# EAGLE design test (EAGLE 6.1)
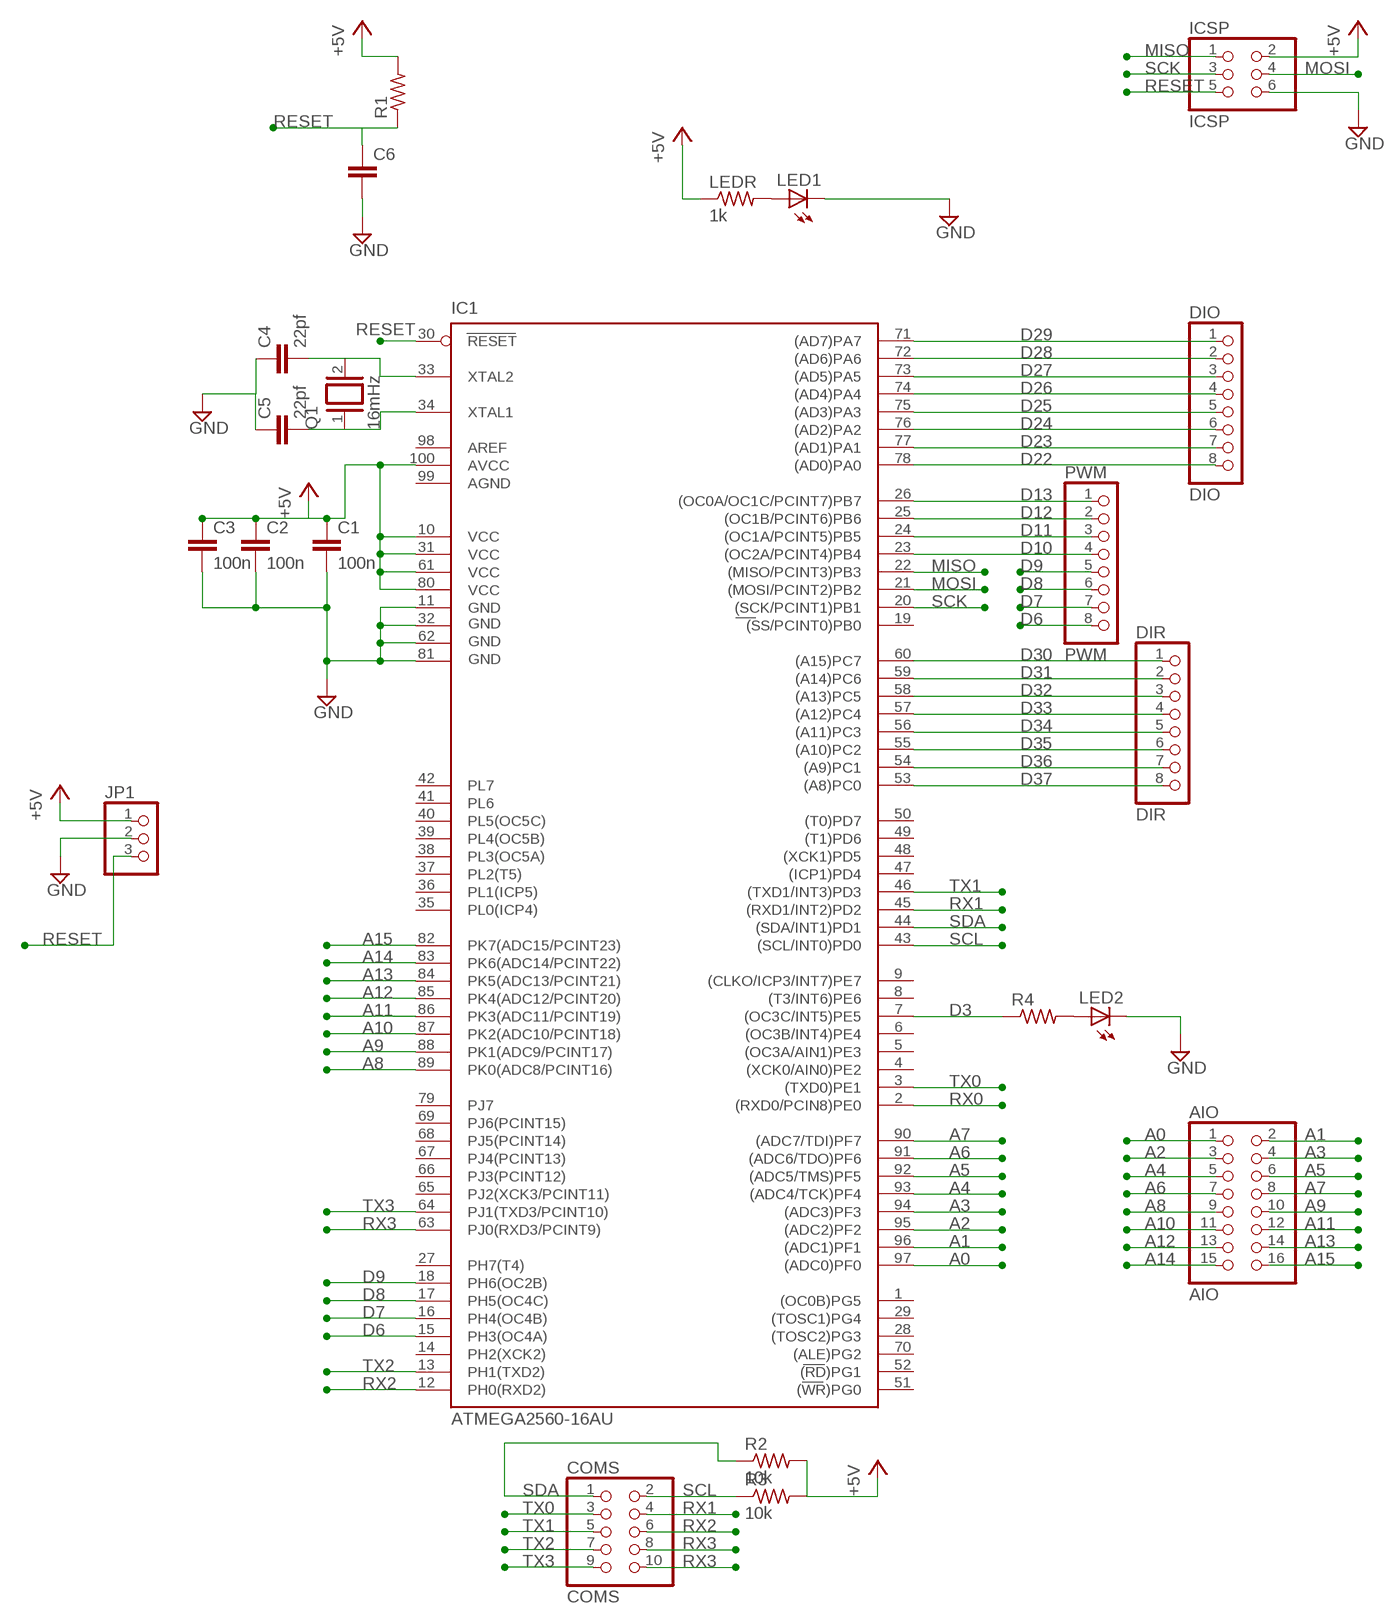
[diagram p0: schematic, sheet 1]

## Parts
AIO  AIO  PINHD-2X8  [2X08]
C1  100n  C5/3.5  [C5B3.5]
C2  100n  C5/3.5  [C5B3.5]
C3  100n  C5/3.5  [C5B3.5]
C4  22pf  C5/3.5  [C5B3.5]
C5  22pf  C5/3.5  [C5B3.5]
C6  C5/3.5  [C5B3.5]
COMS  COMS  PINHD-2X5  [2X05]
DIO  DIO  PINHD-1X8  [1X08]
DIR  DIR  PINHD-1X8  [1X08]
IC1  ATMEGA2560-16AU  [TQFP100]
ICSP  ICSP  PINHD-2X3  [2X03]
JP1  PINHD-1X3  [1X03]
LED1  LEDB156  [Q62902-B156]
LED2  LEDB156  [Q62902-B156]
LEDR  1k  R-US_0207/7  [0207/7]
PWM  PWM  PINHD-1X8  [1X08]
Q1  16mHz  XTAL/S  [QS]
R1  R-US_0207/7  [0207/7]
R2  10k  R-US_0207/7  [0207/7]
R3  10k  R-US_0207/7  [0207/7]
R4  R-US_0207/7  [0207/7]

## Nets
+5V: C1.1 C2.1 C3.1 IC1.10(VCC) IC1.31(VCC1) IC1.61(VCC2) IC1.80(VCC3) IC1.100(AVCC) ICSP.2 JP1.1 LEDR.1 R1.2 R2.2 R3.2
A0: AIO.1 IC1.97((ADC0)PF0)
A1: AIO.2 IC1.96((ADC1)PF1)
A2: AIO.3 IC1.95((ADC2)PF2)
A3: AIO.4 IC1.94((ADC3)PF3)
A4: AIO.5 IC1.93((ADC4/TCK)PF4)
A5: AIO.6 IC1.92((ADC5/TMS)PF5)
A6: AIO.7 IC1.91((ADC6/TDO)PF6)
A7: AIO.8 IC1.90((ADC7/TDI)PF7)
A8: AIO.9 IC1.89(PK0(ADC8/PCINT16))
A9: AIO.10 IC1.88(PK1(ADC9/PCINT17))
A10: AIO.11 IC1.87(PK2(ADC10/PCINT18))
A11: AIO.12 IC1.86(PK3(ADC11/PCINT19))
A12: AIO.13 IC1.85(PK4(ADC12/PCINT20))
A13: AIO.14 IC1.84(PK5(ADC13/PCINT21))
A14: AIO.15 IC1.83(PK6(ADC14/PCINT22))
A15: AIO.16 IC1.82(PK7(ADC15/PCINT23))
D3: IC1.7((OC3C/INT5)PE5) R4.1
D6: IC1.15(PH3(OC4A)) PWM.8
D7: IC1.16(PH4(OC4B)) PWM.7
D8: IC1.17(PH5(OC4C)) PWM.6
D9: IC1.18(PH6(OC2B)) PWM.5
D10: IC1.23((OC2A/PCINT4)PB4) PWM.4
D11: IC1.24((OC1A/PCINT5)PB5) PWM.3
D12: IC1.25((OC1B/PCINT6)PB6) PWM.2
D13: IC1.26((OC0A/OC1C/PCINT7)PB7) PWM.1
D22: DIO.8 IC1.78((AD0)PA0)
D23: DIO.7 IC1.77((AD1)PA1)
D24: DIO.6 IC1.76((AD2)PA2)
D25: DIO.5 IC1.75((AD3)PA3)
D26: DIO.4 IC1.74((AD4)PA4)
D27: DIO.3 IC1.73((AD5)PA5)
D28: DIO.2 IC1.72((AD6)PA6)
D29: DIO.1 IC1.71((AD7)PA7)
D30: DIR.1 IC1.60((A15)PC7)
D31: DIR.2 IC1.59((A14)PC6)
D32: DIR.3 IC1.58((A13)PC5)
D33: DIR.4 IC1.57((A12)PC4)
D34: DIR.5 IC1.56((A11)PC3)
D35: DIR.6 IC1.55((A10)PC2)
D36: DIR.7 IC1.54((A9)PC1)
D37: DIR.8 IC1.53((A8)PC0)
GND: C1.2 C2.2 C3.2 C4.1 C5.1 C6.2 IC1.11(GND) IC1.32(GND1) IC1.62(GND2) IC1.81(GND3) ICSP.6 JP1.2 LED1.K(C) LED2.K(C)
MISO: IC1.22((MISO/PCINT3)PB3) ICSP.1
MOSI: IC1.21((MOSI/PCINT2)PB2) ICSP.4
N$1: C4.2 IC1.33(XTAL2) Q1.2
N$2: C5.2 IC1.34(XTAL1) Q1.1
N$3: LED1.A LEDR.2
N$5: LED2.A R4.2
RESET: C6.1 IC1.30(RESET) ICSP.5 JP1.3 R1.1
RX0: IC1.2((RXD0/PCIN8)PE0)
RX1: COMS.4 IC1.45((RXD1/INT2)PD2)
RX2: COMS.6 IC1.12(PH0(RXD2))
RX3: COMS.8 COMS.10 IC1.63(PJ0(RXD3/PCINT9))
SCK: IC1.20((SCK/PCINT1)PB1) ICSP.3
SCL: COMS.2 IC1.43((SCL/INT0)PD0) R3.1
SDA: COMS.1 IC1.44((SDA/INT1)PD1) R2.1
TX0: COMS.3 IC1.3((TXD0)PE1)
TX1: COMS.5 IC1.46((TXD1/INT3)PD3)
TX2: COMS.7 IC1.13(PH1(TXD2))
TX3: COMS.9 IC1.64(PJ1(TXD3/PCINT10))
Unconnected: IC1.1((OC0B)PG5) IC1.4((XCK0/AIN0)PE2) IC1.5((OC3A/AIN1)PE3) IC1.6((OC3B/INT4)PE4) IC1.8((T3/INT6)PE6) IC1.9((CLKO/ICP3/INT7)PE7) IC1.14(PH2(XCK2)) IC1.19((SS/PCINT0)PB0) IC1.27(PH7(T4)) IC1.28((TOSC2)PG3) IC1.29((TOSC1)PG4) IC1.35(PL0(ICP4)) IC1.36(PL1(ICP5)) IC1.37(PL2(T5)) IC1.38(PL3(OC5A)) IC1.39(PL4(OC5B)) IC1.40(PL5(OC5C)) IC1.41(PL6) IC1.42(PL7) IC1.47((ICP1)PD4) IC1.48((XCK1)PD5) IC1.49((T1)PD6) IC1.50((T0)PD7) IC1.51((WR)PG0) IC1.52((RD)PG1) IC1.65(PJ2(XCK3/PCINT11)) IC1.66(PJ3(PCINT12)) IC1.67(PJ4(PCINT13)) IC1.68(PJ5(PCINT14)) IC1.69(PJ6(PCINT15)) IC1.70((ALE)PG2) IC1.79(PJ7) IC1.98(AREF)

## Power pins joined to a net without a drawn wire
AGND: IC1.99(AGND)

## Library data of the parts
AIO = pinhead:PINHD-2X8: PIN HEADER
C1-C6 = capacitor-wima:C: CAPACITOR naming: grid - package width
COMS = pinhead:PINHD-2X5: PIN HEADER
DIO DIR PWM = pinhead:PINHD-1X8: PIN HEADER
IC1 = atmel-2005:ATMEGA*: MICROCONTROLLER 64/128/256 Kbytes FLASH 4 Kbytes EEPROM 8 Kbytes SRAM 86 General Purpose I/O pins 12-channels16-bit PWM 4 x Serial USARTs 16-channels 10-bit A/D
ICSP = pinhead:PINHD-2X3: PIN HEADER
JP1 = pinhead:PINHD-1X3: PIN HEADER
LED1 LED2 = led:LED: LED OSRAM: - CHIPLED LG R971, LG N971, LY N971, LG Q971, LY Q971, LO R971, LY R971 LH N974, LH R974 LS Q976, LO Q976, LY Q976 LO Q996 - Hyper CHIPLED LW Q18S LB Q993, LB Q99A, LB R99A - SideLED LS A670, LO A670, LY A670, LG A670, LP A670 LB A673, LV A673, LT A673, LW A673 LH A674 LY A675 LS A676, LA A676, LO A676, LY A676, LW A676 LS A679, LY A679, LG A679 - Hyper Micro SIDELED® LS Y876, LA Y876, LO Y876, LY Y876 LT Y87S - SmartLED LW L88C, LW L88S LB L89C, LB L89S, LG L890 LS L89K, LO L89K, LY L89K LS L896, LA L896, LO L896, LY L896 - TOPLED LS T670, LO T670, LY T670, LG T670, LP T670 LSG T670, LSP T670, LSY T670, LOP T670, LYG T670 LG T671, LOG T671, LSG T671 LB T673, LV T673, LT T673, LW T673 LH T674 LS T676, LA T676, LO T676, LY T676, LB T676, LH T676, LSB T676, LW T676 LB T67C, LV T67C, LT T67C, LS T67K, LO T67K, LY T67K, LW E67C LS E67B, LA E67B, LO E67B, LY E67B, LB E67C, LV E67C, LT E67C LW T67C LS T679, LY T679, LG T679 LS T770, LO T770, LY T770, LG T770, LP T770 LB T773, LV T773, LT T773, LW T773 LH T774 LS E675, LA E675, LY E675, LS T675 LS T776, LA T776, LO T776, LY T776, LB T776 LHGB T686 LT T68C, LB T68C - Hyper Mini TOPLED® LB M676 - Mini TOPLED Santana® LG M470 LS M47K, LO M47K, LY M47K Source: http://www.osram.convergy.de LUXEON: - LUMILED® LXK2-PW12-R00, LXK2-PW12-S00, LXK2-PW14-U00, LXK2-PW14-V00 LXK2-PM12-R00, LXK2-PM12-S00, LXK2-PM14-U00 LXK2-PE12-Q00, LXK2-PE12-R00, LXK2-PE12-S00, LXK2-PE14-T00, LXK2-PE14-U00 LXK2-PB12-K00, LXK2-PB12-L00, LXK2-PB12-M00, LXK2-PB14-N00, LXK2-PB14-P00, LXK2-PB14-Q00 LXK2-PR12-L00, LXK2-PR12-M00, LXK2-PR14-Q00, LXK2-PR14-R00 LXK2-PD12-Q00, LXK2-PD12-R00, LXK2-PD12-S00 LXK2-PH12-R00, LXK2-PH12-S00 LXK2-PL12-P00, LXK2-PL12-Q00, LXK2-PL12-R00 Source: www.luxeon.com KINGBRIGHT: KA-3528ASYC Source: www.kingbright.com
LEDR R1 = rcl:R-US_: RESISTOR, American symbol
Q1 = special:XTAL/S: CRYSTAL
R2-R4 = resistor:R-US_: RESISTOR, American symbol

## Board
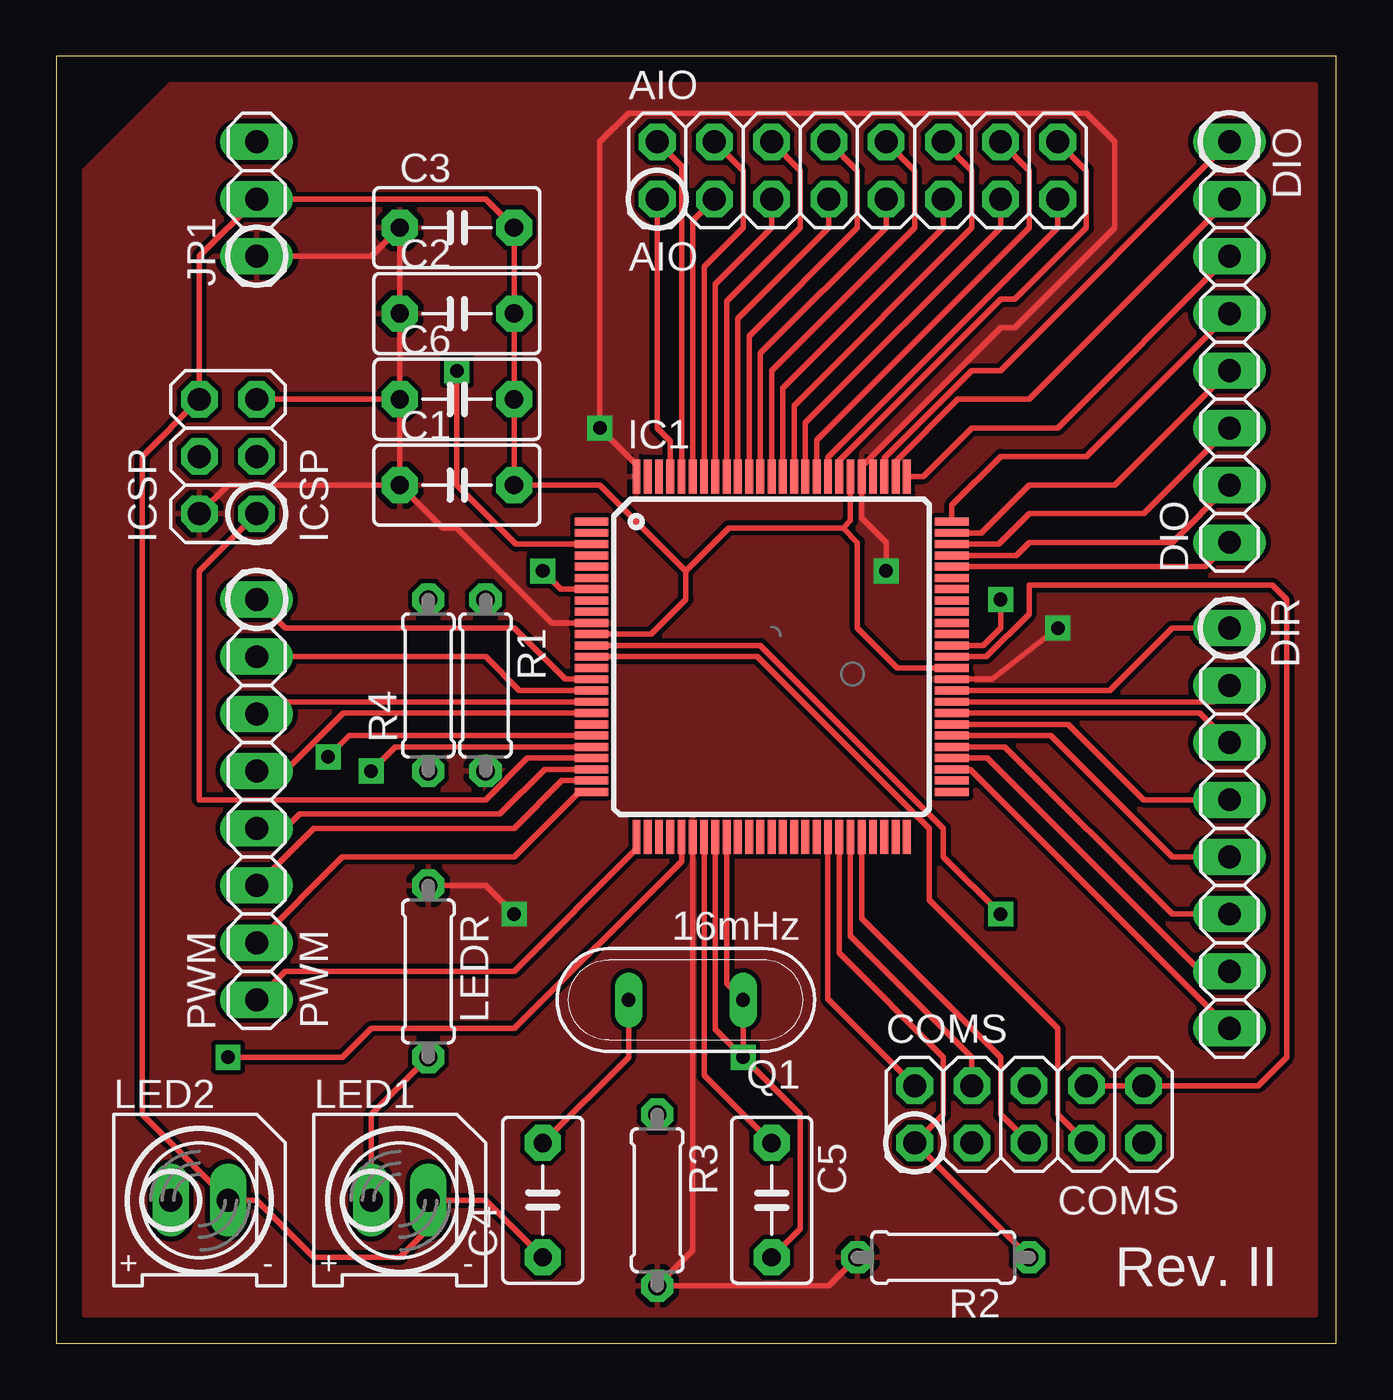
[diagram p1: board, top side]
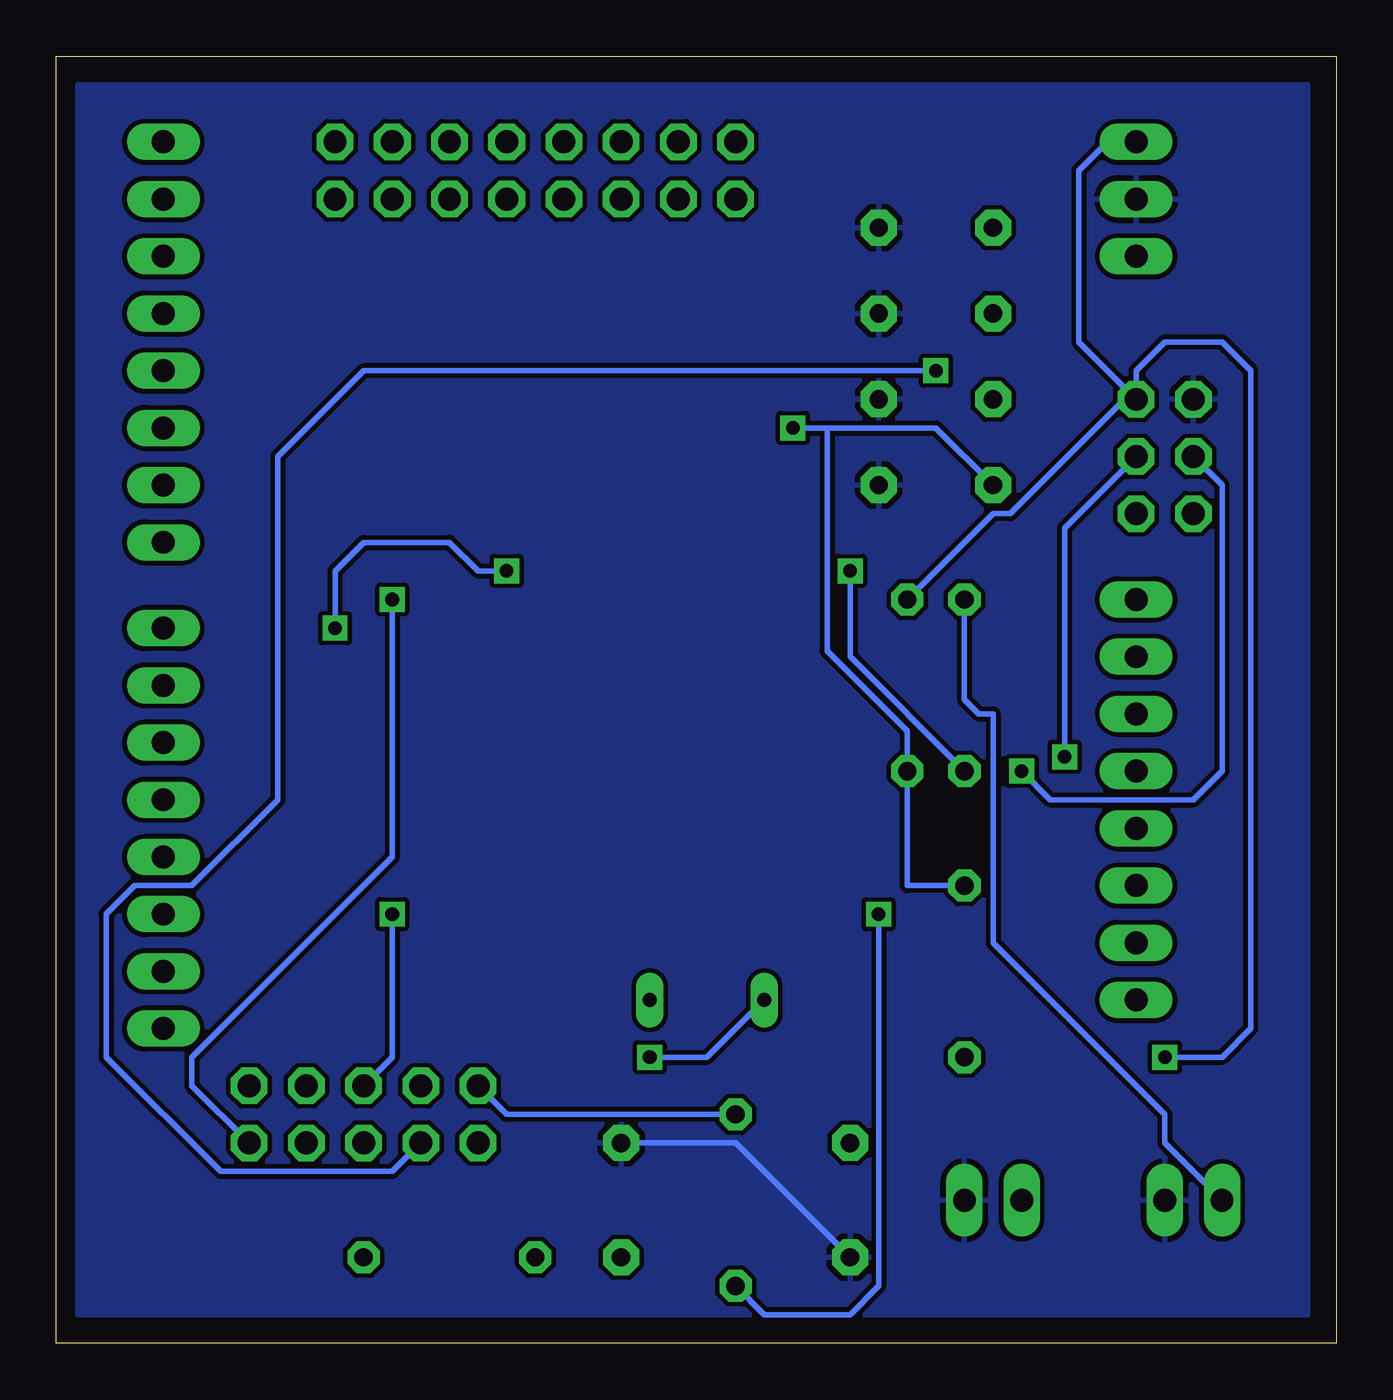
[diagram p2: board, bottom side, seen from below]

Size 56.82 x 57.14 mm. Coordinates in mm from the lower left corner, seen from the top.
Outline: 0,0 56.82,0 56.82,57.14 0,57.14 0,0
Copper layers (1*16): Top 0.035mm / dielectric 1.5mm / Bottom 0.035mm
Design rules: minimum track width 8mil, minimum drill 20mil, track to track 8mil, track to pad 8mil, pad to pad 8mil, via to via 8mil, smd to smd 8mil, copper to edge 10mil, drill to drill 8mil, minimum pad ring 12mil, minimum via ring 10mil, stop-mask expansion 4mil, vias tented up to drill 25mil, thermal gap 10mil

### Footprints (pad centres in the part's own frame; a part is rotated, then mirrored left to right if it is on the bottom)
2X08 = drill 1.016 octagon: 1 -8.89,-1.27; 2 -8.89,1.27; 3 -6.35,-1.27; 4 -6.35,1.27; 5 -3.81,-1.27; 6 -3.81,1.27; 7 -1.27,-1.27; 8 -1.27,1.27; 9 1.27,-1.27; 10 1.27,1.27; 11 3.81,-1.27; 12 3.81,1.27; 13 6.35,-1.27; 14 6.35,1.27; 15 8.89,-1.27; 16 8.89,1.27
C5B3.5 = drill 0.813 pad 1.6 octagon: 1 -2.54,0; 2 2.54,0
2X05 = drill 1.016 octagon: 1 -5.08,-1.27; 2 -5.08,1.27; 3 -2.54,-1.27; 4 -2.54,1.27; 5 0,-1.27; 6 0,1.27; 7 2.54,-1.27; 8 2.54,1.27; 9 5.08,-1.27; 10 5.08,1.27
1X08 = drill 1.016 long: 1 -8.89,0; 2 -6.35,0; 3 -3.81,0; 4 -1.27,0; 5 1.27,0; 6 3.81,0; 7 6.35,0; 8 8.89,0
TQFP100 = smd 1.5 x 0.35: 1 -8,6; 2 -8,5.5; 3 -8,5; 4 -8,4.5; 5 -8,4; 6 -8,3.5; 7 -8,3; 8 -8,2.5; 9 -8,2; 10 -8,1.5; 11 -8,1; 12 -8,0.5; 13 -8,0; 14 -8,-0.5; 15 -8,-1; 16 -8,-1.5; 17 -8,-2; 18 -8,-2.5; 19 -8,-3; 20 -8,-3.5; 21 -8,-4; 22 -8,-4.5; 23 -8,-5; 24 -8,-5.5; 25 -8,-6; 51 8,-6; 52 8,-5.5; 53 8,-5; 54 8,-4.5; 55 8,-4; 56 8,-3.5; 57 8,-3; 58 8,-2.5; 59 8,-2; 60 8,-1.5; 61 8,-1; 62 8,-0.5; 63 8,0; 64 8,0.5; 65 8,1; 66 8,1.5; 67 8,2; 68 8,2.5; 69 8,3; 70 8,3.5; 71 8,4; 72 8,4.5; 73 8,5; 74 8,5.5; 75 8,6 | smd 0.35 x 1.5: 26 -6,-8; 27 -5.5,-8; 28 -5,-8; 29 -4.5,-8; 30 -4,-8; 31 -3.5,-8; 32 -3,-8; 33 -2.5,-8; 34 -2,-8; 35 -1.5,-8; 36 -1,-8; 37 -0.5,-8; 38 0,-8; 39 0.5,-8; 40 1,-8; 41 1.5,-8; 42 2,-8; 43 2.5,-8; 44 3,-8; 45 3.5,-8; 46 4,-8; 47 4.5,-8; 48 5,-8; 49 5.5,-8; 50 6,-8; 76 6,8; 77 5.5,8; 78 5,8; 79 4.5,8; 80 4,8; 81 3.5,8; 82 3,8; 83 2.5,8; 84 2,8; 85 1.5,8; 86 1,8; 87 0.5,8; 88 0,8; 89 -0.5,8; 90 -1,8; 91 -1.5,8; 92 -2,8; 93 -2.5,8; 94 -3,8; 95 -3.5,8; 96 -4,8; 97 -4.5,8; 98 -5,8; 99 -5.5,8; 100 -6,8
2X03 = drill 1.016 octagon: 1 -2.54,-1.27; 2 -2.54,1.27; 3 0,-1.27; 4 0,1.27; 5 2.54,-1.27; 6 2.54,1.27
1X03 = drill 1.016 long: 1 -2.54,0; 2 0,0; 3 2.54,0
Q62902-B156 = drill 1.016 long: A -1.27,0; K 1.27,0
0207/7 = drill 0.813 octagon: 1 -3.81,0; 2 3.81,0
QS = drill 0.61 long: 1 -2.54,0; 2 2.54,0

### Placement (x,y rotation side)
AIO  35.56,52.07 0 top
C1  17.78,38.1 0 top
C2  17.78,45.72 0 top
C3  17.78,49.53 0 top
C4  21.59,6.35 90 top
C5  31.75,6.35 270 top
C6  17.78,41.91 0 top
COMS  43.18,10.16 0 top
DIO  52.07,44.45 90 top
DIR  52.07,22.86 270 top
IC1  31.75,30.48 0 top
ICSP  7.62,39.37 90 top
JP1  8.89,50.8 90 top
LED1  15.24,6.35 0 top
LED2  6.35,6.35 0 top
LEDR  16.51,16.51 270 top
PWM  8.89,24.13 90 top
Q1  27.94,15.24 180 top
R1  19.05,29.21 270 top
R2  39.37,3.81 180 top
R3  26.67,6.35 270 top
R4  16.51,29.21 90 top

### Tracks (layer width: path | path; a pad name or v marks a point on that pad's centre or on a via)
+5V  (via drill 0.6)
  Top 0.254: IC1.31 28.25,4.12 R3.2 34.29,2.54 R2.2 | C1.1 7.62,38.1 ICSP.2 | IC1.10 21.99,31.98 17.78,36.2 17.15,36.2 C1.1 | C1.1 C2.1 C3.1 13.97,48.26 JP1.1 | IC1.100 25.75,39.02 v24.13,40.64 24.13,53.34 25.4,54.61 45.72,54.61 46.99,53.34 46.99,49.53 42.55,45.08 41.91,45.08 35.75,38.92 IC1.80 35.75,36.64 36.83,35.56 v36.83,34.29 | LEDR.1 19.05,20.32 v20.32,19.05 | IC1.61 41.55,29.48 v44.45,31.75
  Bottom 0.254: v24.13,40.64 22.61,40.64 | 22.61,40.64 17.78,40.64 C1.1 | v20.32,19.05 20.32,2.54 21.59,1.27 25.4,1.27 R3.2 | LEDR.1 19.05,20.32 R1.2 19.05,27.18 22.61,30.73 22.61,40.64 | v44.45,31.75 44.45,34.29 43.18,35.56 39.37,35.56 38.1,34.29 v36.83,34.29
  pour Top: 1.27,52.07 5.08,55.88 55.88,55.88 55.88,1.27 1.27,1.27
A0
  Top 0.254: IC1.97 27.25,40.06 26.67,40.64 AIO.1
A1
  Top 0.254: IC1.96 27.75,52.26 AIO.2
A2
  Top 0.254: IC1.95 28.25,49.84 AIO.3
A3
  Top 0.254: IC1.94 28.75,47.8 30.48,49.53 30.48,52.07 AIO.4
A4
  Top 0.254: IC1.93 29.25,47.03 31.75,49.53 AIO.5
A5
  Top 0.254: IC1.92 29.75,46.26 33.02,49.53 33.02,52.07 AIO.6
A6
  Top 0.254: IC1.91 30.25,45.49 34.29,49.53 AIO.7
A7
  Top 0.254: IC1.90 30.75,44.72 35.56,49.53 35.56,52.07 AIO.8
A8
  Top 0.254: IC1.89 31.25,43.95 36.83,49.53 AIO.9
A9
  Top 0.254: IC1.88 31.75,43.18 38.1,49.53 38.1,52.07 AIO.10
A10
  Top 0.254: IC1.87 32.25,42.41 39.37,49.53 AIO.11
A11
  Top 0.254: IC1.86 32.75,41.64 40.64,49.53 40.64,52.07 AIO.12
A12
  Top 0.254: IC1.85 33.25,40.87 41.91,49.53 AIO.13
A13
  Top 0.254: IC1.84 33.75,40.1 43.18,49.53 43.18,52.07 AIO.14
A14
  Top 0.254: IC1.83 34.25,39.33 44.45,49.53 AIO.15
A15
  Top 0.254: AIO.16 45.72,52.07 45.72,49.53 42.55,46.36 41.91,46.36 34.75,39.2 IC1.82
D3  (via drill 0.6)
  Top 0.254: IC1.7 22.4,33.48 v21.59,34.29
  Bottom 0.254: v21.59,34.29 21.59,30.48 R4.1
D6
  Top 0.254: IC1.15 22.59,29.48 20.32,31.75 10.16,31.75 PWM.8
D7
  Top 0.254: IC1.16 20.55,28.98 19.05,30.48 PWM.7
D8
  Top 0.254: IC1.17 9.43,28.48 PWM.6
D9
  Top 0.254: IC1.18 12.74,27.98 10.16,25.4 PWM.5
D10
  Top 0.254: IC1.23 21.67,25.48 19.69,23.5 10.8,23.5 10.16,22.86 PWM.4
D11
  Top 0.254: IC1.24 22.44,24.98 20.32,22.86 11.43,22.86 PWM.3
D12
  Top 0.254: IC1.25 23.21,24.48 20.32,21.59 12.7,21.59 PWM.2
D13
  Top 0.254: IC1.26 25.75,21.94 20.32,16.51 10.16,16.51 PWM.1
D22
  Top 0.254: IC1.78 36.75,39.29 40.64,43.18 41.91,43.18 DIO.8
D23
  Top 0.254: IC1.77 37.25,39.16 40.01,41.91 43.18,41.91 DIO.7
D24
  Top 0.254: IC1.76 38.48,38.48 40.64,40.64 44.45,40.64 DIO.6
D25
  Top 0.254: IC1.75 39.75,37.21 41.91,39.37 45.72,39.37 DIO.5
D26
  Top 0.254: IC1.74 41.06,35.98 43.18,38.1 46.99,38.1 DIO.4
D27
  Top 0.254: IC1.73 41.83,35.48 43.18,36.83 48.26,36.83 DIO.3
D28
  Top 0.254: IC1.72 42.6,34.98 43.18,35.56 49.53,35.56 DIO.2
D29
  Top 0.254: IC1.71 50.99,34.48 DIO.1
D30
  Top 0.254: IC1.60 46.76,28.98 49.53,31.75 DIR.1
D31
  Top 0.254: IC1.59 51.34,28.48 DIR.2
D32
  Top 0.254: IC1.58 50.76,27.98 DIR.3
D33
  Top 0.254: IC1.57 44.91,27.48 48.26,24.13 DIR.4
D34
  Top 0.254: IC1.56 44.14,26.98 49.53,21.59 DIR.5
D35
  Top 0.254: IC1.55 42.1,26.48 49.53,19.05 DIR.6
D36
  Top 0.254: IC1.54 41.33,25.98 50.8,16.51 DIR.7
D37
  Top 0.254: IC1.53 40.56,25.48 DIR.8
GND
  Top 0.254: IC1.32 28.75,11.89 C5.1 | IC1.11 26.4,31.48 27.94,33.02 27.94,34.29 | 27.94,34.29 29.84,36.2 34.92,36.2 | IC1.81 35.25,36.52 34.92,36.2 | IC1.62 37.33,29.98 35.56,31.75 35.56,35.56 34.92,36.2 | 27.94,34.29 24.13,38.1 C1.2 C6.2 C2.2 C3.2 19.05,50.8 JP1.2 6.35,48.26 ICSP.6 3.81,39.37 3.81,10.16 LED2.K 8.89,6.35 11.43,3.81 15.24,3.81 16.51,5.08 LED1.K 19.05,6.35 C4.1
  Bottom 0.254: C5.1 26.67,8.89 C4.1
  pour Bottom: 1.27,52.07 1.27,55.88 55.88,55.88 55.88,1.27 1.27,1.27
MISO
  Top 0.254: IC1.22 20.9,25.98 19.05,24.13 6.35,24.13 6.35,34.29 ICSP.1
MOSI  (via drill 0.6)
  Top 0.254: IC1.21 15.05,26.48 v13.97,25.4
  Bottom 0.254: v13.97,25.4 12.7,24.13 6.35,24.13 5.08,25.4 5.08,38.1 ICSP.4
N$1  (via drill 0.6)
  Top 0.254: IC1.33 29.25,13.93 v30.48,12.7 | Q1.2 25.4,12.7 C4.2
  Bottom 0.254: v30.48,12.7 27.94,12.7 Q1.2
N$2
  Top 0.254: IC1.34 29.75,15.97 Q1.1 30.48,12.7 33.02,10.16 33.02,5.08 C5.2
N$3
  Top 0.254: LED1.A 13.97,10.16 LEDR.2
N$5
  Bottom 0.254: R4.2 16.51,28.57 15.88,27.94 15.24,27.94 15.24,17.78 7.62,10.16 7.62,8.89 LED2.A
RESET  (via drill 0.6)
  Top 0.254: ICSP.5 C6.1 | IC1.30 27.75,21.4 20.32,13.97 13.97,13.97 12.7,12.7 v7.62,12.7
  Bottom 0.254: JP1.3 10.16,53.34 11.43,52.07 11.43,44.45 9.14,42.16 | R1.1 15.24,36.83 14.48,36.83 9.14,42.16 | 9.14,42.16 ICSP.5 8.89,43.18 7.62,44.45 5.08,44.45 3.81,43.18 3.81,13.97 5.08,12.7 v7.62,12.7
RX1
  Top 0.254: IC1.45 35.25,18.09 40.64,12.7 COMS.4
RX2  (via drill 0.6)
  Top 0.254: IC1.12 31.25,30.98 39.37,22.86 39.37,21.59 v41.91,19.05
  Bottom 0.254: v41.91,19.05 41.91,12.7 COMS.6
RX3
  Top 0.254: COMS.8 COMS.10 53.34,11.43 54.61,12.7 54.61,33.02 53.97,33.66 43.18,33.66 43.18,32.39 41.28,30.48 IC1.63
SCK  (via drill 0.6)
  Top 0.254: IC1.20 13.01,26.98 v12.06,26.04
  Bottom 0.254: v12.06,26.04 12.06,36.2 ICSP.3
SCL
  Top 0.254: IC1.43 34.25,15.28 COMS.2
  Bottom 0.254: R3.1 36.83,10.16 COMS.2
SDA
  Top 0.254: IC1.44 34.75,17.32 39.37,12.7 39.37,10.16 COMS.1 R2.1
TX0  (via drill 0.6)
  Top 0.254: IC1.3 20.4,35.48 17.78,38.1 v17.78,43.18
  Bottom 0.254: v17.78,43.18 43.18,43.18 46.99,39.37 46.99,24.13 50.8,20.32 53.34,20.32 54.61,19.05 54.61,12.7 49.53,7.62 41.91,7.62 COMS.3
TX1
  Top 0.254: IC1.46 35.75,18.86 41.91,12.7 41.91,10.16 COMS.5
TX2
  Top 0.254: IC1.13 31.12,30.48 38.73,22.86 38.73,19.68 44.45,13.97 44.45,10.16 COMS.7
TX3  (via drill 0.6)
  Top 0.254: IC1.64 41.14,30.98 41.91,31.75 v41.91,33.02
  Bottom 0.254: v41.91,33.02 41.91,21.59 50.8,12.7 50.8,11.43 COMS.9

### Text on the board
tPlace: Rev. II